# Altium schematic sheet Antenna Deployment.SchDoc
size A3; SheetNumber: 4; SheetTotal: 5
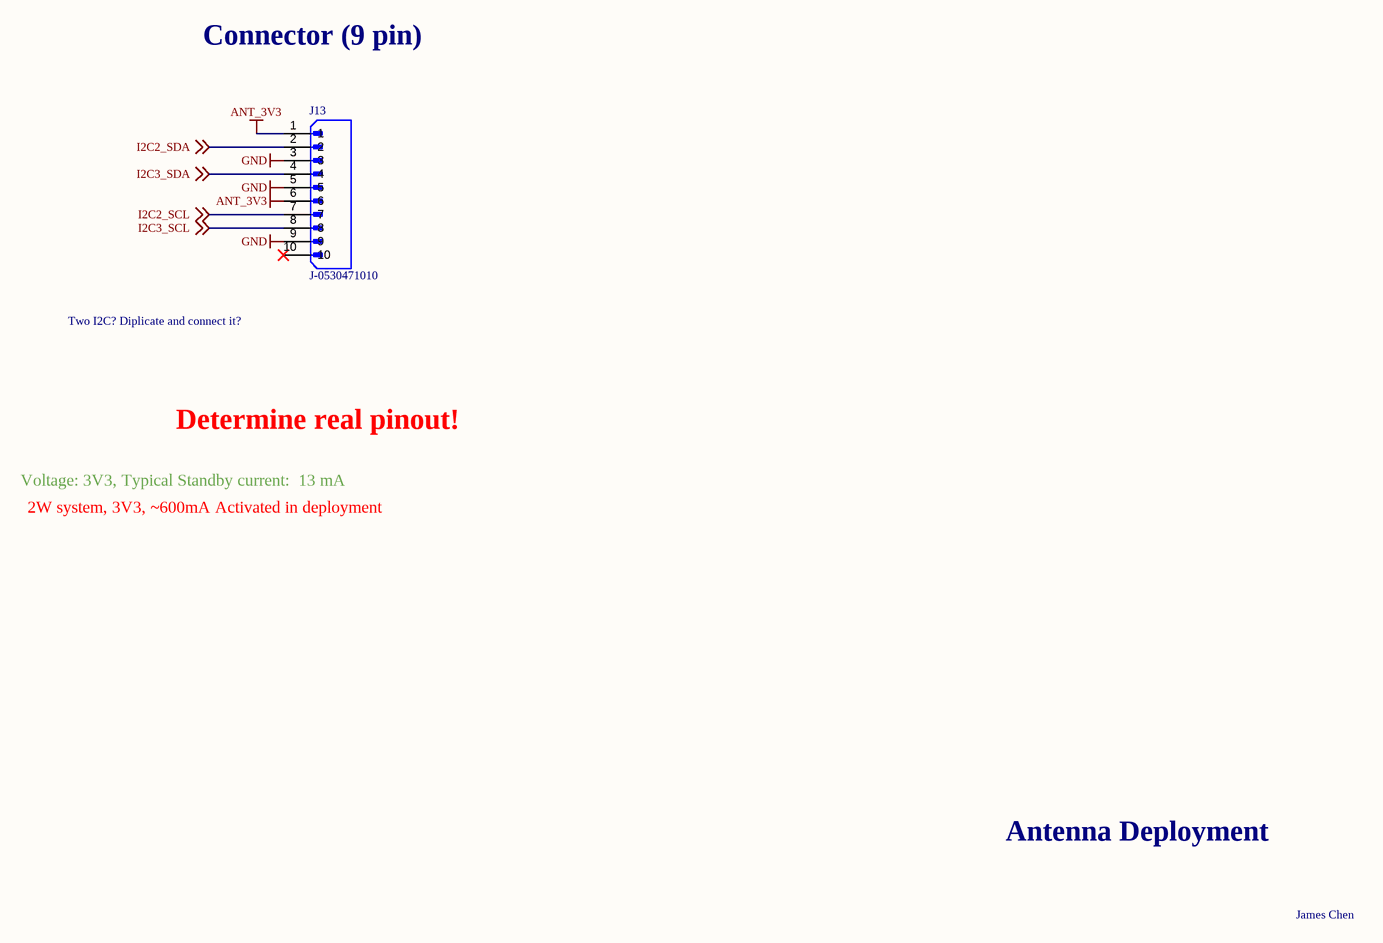
[diagram p0: Antenna Deployment.SchDoc]

## Parts
J13  J-0530471010  [J-0530471010]

## Nets
ANT_3V3: J13.1 J13.6
GND: J13.3 J13.5 J13.9
I2C2_SCL: J13.7 ; off-sheet I2C2_SCL
I2C2_SDA: J13.2 ; off-sheet I2C2_SDA
I2C3_SCL: J13.8 ; off-sheet I2C3_SCL
I2C3_SDA: J13.4 ; off-sheet I2C3_SDA

Not connected (* = marked no-connect by the designer): J13 10*

## Notes on the sheet
- Connector (9 pin)
- Two I2C? Diplicate and connect it?
- Determine real pinout!
- Voltage: 3V3, Typical Standby current:  13 mA
- 2W system, 3V3, ~600mA Activated in deployment
- Antenna Deployment
- James Chen
- THIS DOCUMENT AND THE DATA DISCLOSED HEREIN OR
- HEREWITH IS THE PROPERTY OF ALTIUM LIMITED AND MAY
- DWG NO:
- REVISION
- REV:
- DESCRIPTION
- DATE
- APPROVED
- BE FREELY DISTRIBUTED IN WHOLE. NO RIGHTS ARE
- RESERVED OR EXPRESS OR IMPLIED WARANTEE GIVEN.
- ENG:
- APPROVALS
- PROJECT
- DSN:
- CHK:
- REFERENCE DOCUMENTS
- PROJECT REVISION:
- TITLE
- DOCUMENT REVISION:
- DESIGN ITEM:
- BOM:
- FAB DWG:
- PCB DWG:
- ASSY DWG:
- SCALE:
- A3
- SIZE
- CAGE CODE
- FILE NAME
- DWG NO.
- SHEET
- OF
- REV

## Library data of the parts
J13 = J-0530471010: CONN HEADER VERT 10POS 1.25MM; Manufacturer: Molex; Manufacturer Part #: 0530471010; Distributor: Digikey; Distributor Part #: WM1739-ND